# EAGLE design Driver Board Invert (EAGLE 9.2.2)
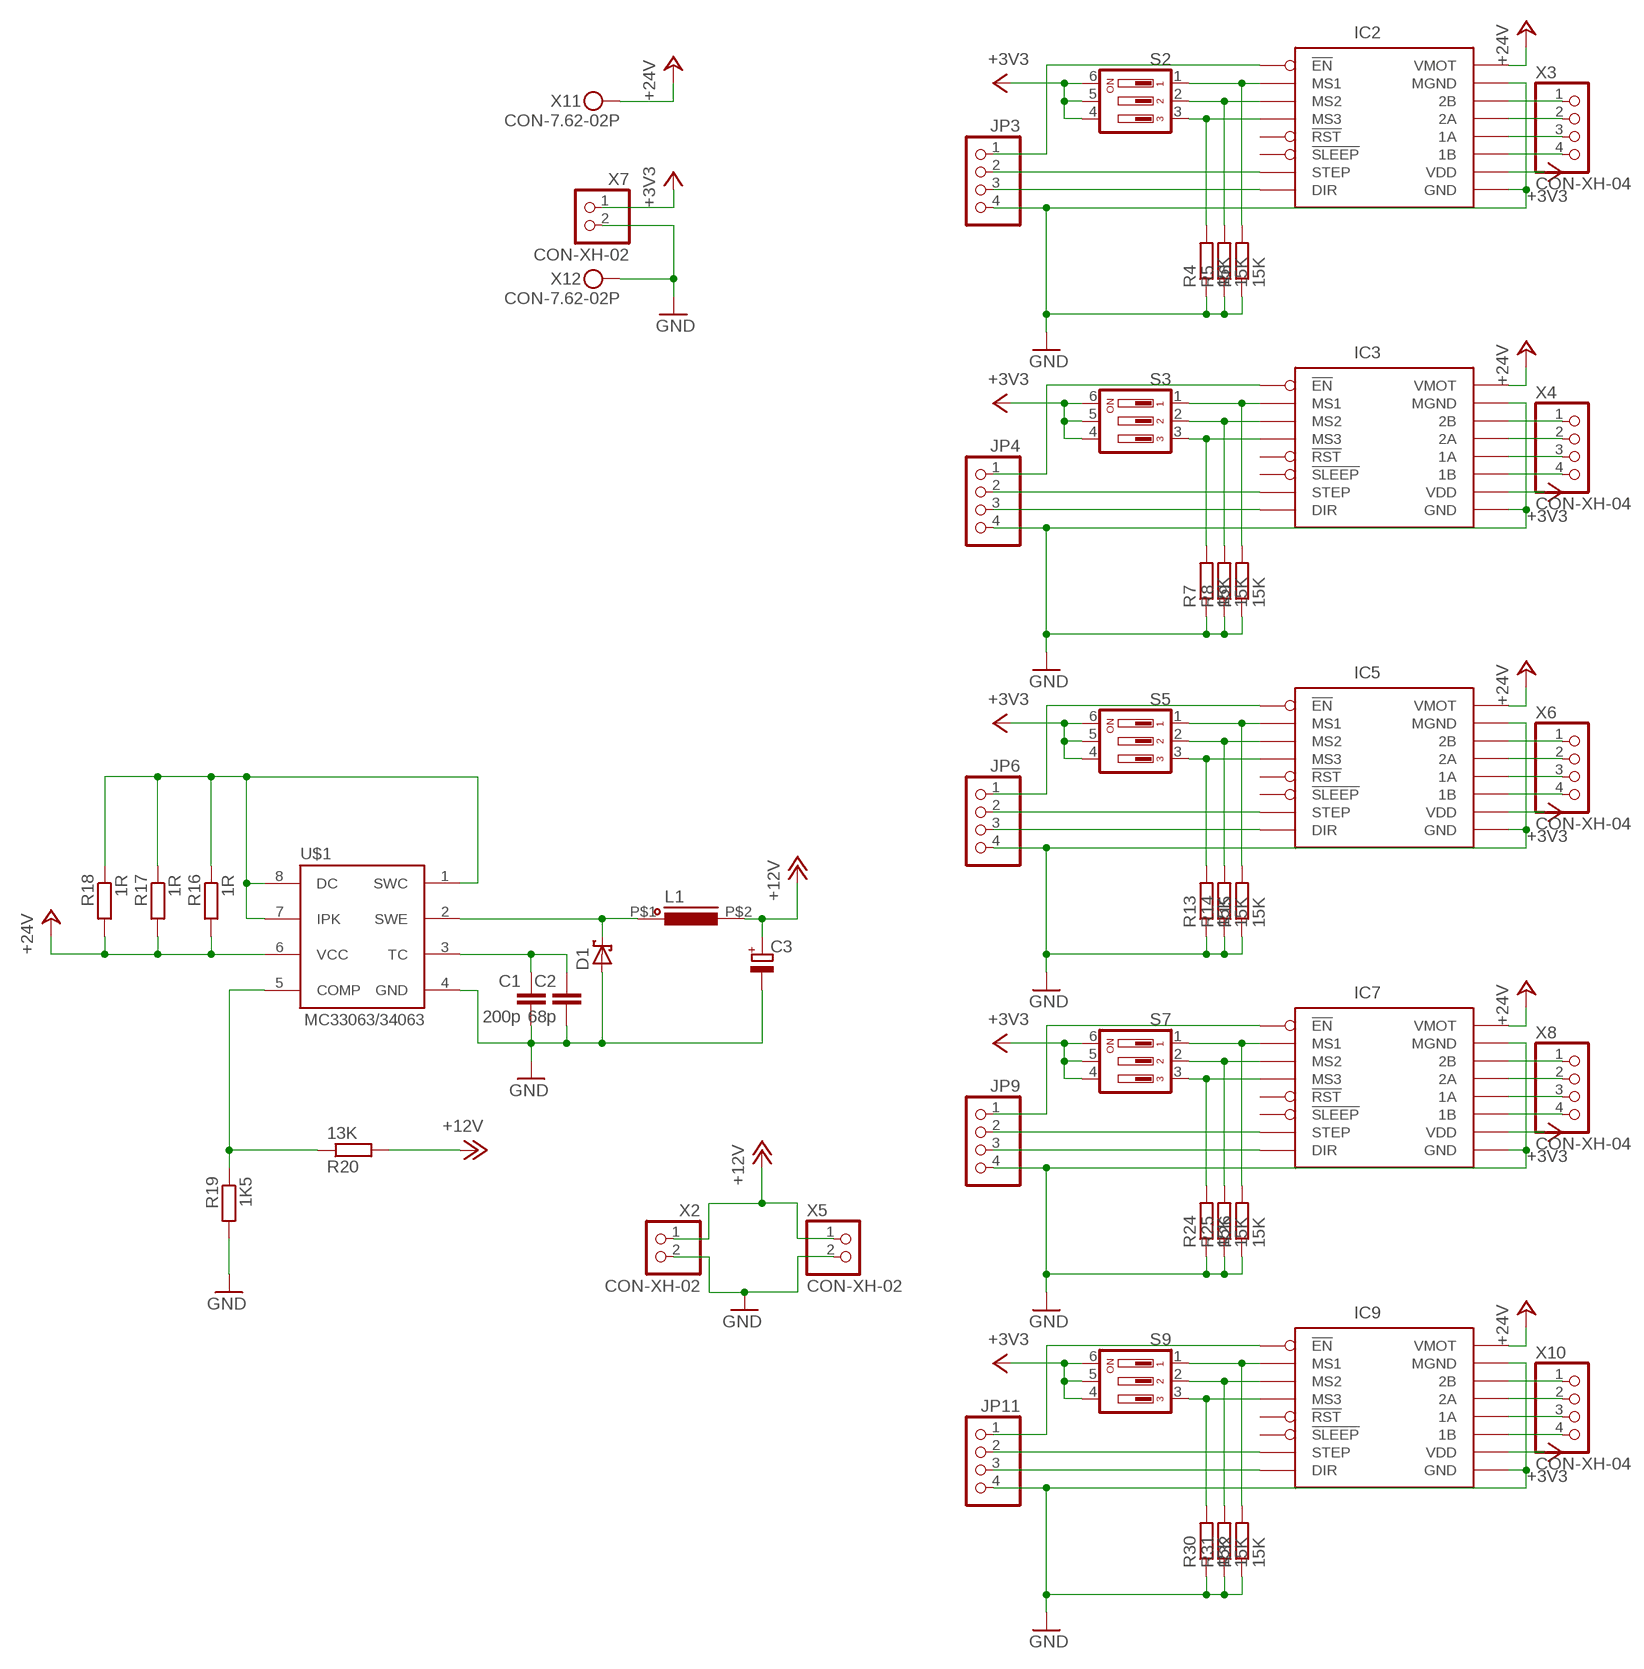
[diagram p0: schematic, sheet 1]

## Parts
C1  200p  CAP_0805  [C0805]
C2  68p  CAP_0805  [C0805]
C3  CAP-POL_E3.5-8  [E3,5-8]
D1  DIODE-SH_SMA  [DO214AC]
IC2  STEP-DRVST820-REV  [DRV-ST820-REV]
IC3  STEP-DRVST820-REV  [DRV-ST820-REV]
IC5  STEP-DRVST820-REV  [DRV-ST820-REV]
IC7  STEP-DRVST820-REV  [DRV-ST820-REV]
IC9  STEP-DRVST820-REV  [DRV-ST820-REV]
JP3  PINHD-1X4  [1X04]
JP4  PINHD-1X4  [1X04]
JP6  PINHD-1X4  [1X04]
JP9  PINHD-1X4  [1X04]
JP11  PINHD-1X4  [1X04]
L1  INDUCTORCW68  [CW68]
R4  15K  R_R0805  [RESC2012X50]
R5  15K  R_R0805  [RESC2012X50]
R6  15K  R_R0805  [RESC2012X50]
R7  15K  R_R0805  [RESC2012X50]
R8  15K  R_R0805  [RESC2012X50]
R9  15K  R_R0805  [RESC2012X50]
R13  15K  R_R0805  [RESC2012X50]
R14  15K  R_R0805  [RESC2012X50]
R15  15K  R_R0805  [RESC2012X50]
R16  1R  R_0805  [R0805]
R17  1R  R_0805  [R0805]
R18  1R  R_0805  [R0805]
R19  1K5  R_0805  [R0805]
R20  13K  R_0805  [R0805]
R24  15K  R_R0805  [RESC2012X50]
R25  15K  R_R0805  [RESC2012X50]
R26  15K  R_R0805  [RESC2012X50]
R30  15K  R_R0805  [RESC2012X50]
R31  15K  R_R0805  [RESC2012X50]
R32  15K  R_R0805  [RESC2012X50]
S2  SW-DIP03S  [DIP03YL]
S3  SW-DIP03S  [DIP03YL]
S5  SW-DIP03S  [DIP03YL]
S7  SW-DIP03S  [DIP03YL]
S9  SW-DIP03S  [DIP03YL]
U$1  MC33063/MC34063P  [DIL08]
X1  CON-7.62-02P  [KF25C-7.62-02P-13]
X2  CON-XH-02  [XH-02]
X3  CON-XH-04  [XH-04]
X4  CON-XH-04  [XH-04]
X5  CON-XH-02  [XH-02]
X6  CON-XH-04  [XH-04]
X7  CON-XH-02  [XH-02]
X8  CON-XH-04  [XH-04]
X10  CON-XH-04  [XH-04]

## Nets
+3V3: IC2.VDD IC3.VDD IC5.VDD IC7.VDD IC9.VDD S2.4 S2.5 S2.6 S3.4 S3.5 S3.6 S5.4 S5.5 S5.6 S7.4 S7.5 S7.6 S9.4 S9.5 S9.6 X7.1
+12V: C3.+ L1.P$2 R20.2 X2.1 X5.1
+24V: IC2.VM(VMOT) IC3.VM(VMOT) IC5.VM(VMOT) IC7.VM(VMOT) IC9.VM(VMOT) R16.2 R17.2 R18.2 U$1.6(VCC) X1.P$1
GND: C1.2 C2.2 C3.- D1.A IC2.GND@1(MGND) IC2.GND@2(GND) IC3.GND@1(MGND) IC3.GND@2(GND) IC5.GND@1(MGND) IC5.GND@2(GND) IC7.GND@1(MGND) IC7.GND@2(GND) IC9.GND@1(MGND) IC9.GND@2(GND) JP3.4 JP4.4 JP6.4 JP9.4 JP11.4 R4.1 R5.1 R6.1 R7.1 R8.1 R9.1 R13.1 R14.1 R15.1 R19.2 R24.1 R25.1 R26.1 R30.1 R31.1 R32.1 U$1.4(GND) X1.P$2 X2.2 X5.2 X7.2
N$9: IC2.EN(!EN) JP3.1
N$10: IC2.STEP JP3.2
N$11: IC2.DIR JP3.3
N$14: IC2.1B(2B) X3.1
N$15: IC2.2B(2A) X3.2
N$16: IC2.2A(1A) X3.3
N$17: IC2.1A(1B) X3.4
N$18: IC2.MS0(MS1) R6.2 S2.1
N$19: IC2.MS1(MS2) R5.2 S2.2
N$20: IC2.MS2(MS3) R4.2 S2.3
N$21: IC3.EN(!EN) JP4.1
N$22: IC3.STEP JP4.2
N$23: IC3.DIR JP4.3
N$24: IC3.1B(2B) X4.1
N$25: IC3.2B(2A) X4.2
N$26: IC3.2A(1A) X4.3
N$27: IC3.1A(1B) X4.4
N$28: IC3.MS0(MS1) R9.2 S3.1
N$29: IC3.MS1(MS2) R8.2 S3.2
N$30: IC3.MS2(MS3) R7.2 S3.3
N$41: IC5.EN(!EN) JP6.1
N$42: IC5.STEP JP6.2
N$43: IC5.DIR JP6.3
N$44: IC5.1B(2B) X6.1
N$45: IC5.2B(2A) X6.2
N$46: IC5.2A(1A) X6.3
N$47: IC5.1A(1B) X6.4
N$48: IC5.MS0(MS1) R15.2 S5.1
N$49: IC5.MS1(MS2) R14.2 S5.2
N$50: IC5.MS2(MS3) R13.2 S5.3
N$51: C1.1 C2.1 U$1.3(TC)
N$52: R16.1 R17.1 R18.1 U$1.1(SWC) U$1.7(IPK) U$1.8(DC)
N$54: D1.C L1.P$1 U$1.2(SWE)
N$55: R19.1 R20.1 U$1.5(COMP)
N$65: IC7.EN(!EN) JP9.1
N$66: IC7.STEP JP9.2
N$67: IC7.DIR JP9.3
N$68: IC7.1B(2B) X8.1
N$69: IC7.2B(2A) X8.2
N$70: IC7.2A(1A) X8.3
N$71: IC7.1A(1B) X8.4
N$72: IC7.MS0(MS1) R26.2 S7.1
N$73: IC7.MS1(MS2) R25.2 S7.2
N$74: IC7.MS2(MS3) R24.2 S7.3
N$85: IC9.EN(!EN) JP11.1
N$86: IC9.STEP JP11.2
N$87: IC9.DIR JP11.3
N$88: IC9.1B(2B) X10.1
N$89: IC9.2B(2A) X10.2
N$90: IC9.2A(1A) X10.3
N$91: IC9.1A(1B) X10.4
N$92: IC9.MS0(MS1) R32.2 S9.1
N$93: IC9.MS1(MS2) R31.2 S9.2
N$94: IC9.MS2(MS3) R30.2 S9.3
Unconnected: IC2.NC(!SLEEP) IC2.RST(!RST) IC3.NC(!SLEEP) IC3.RST(!RST) IC5.NC(!SLEEP) IC5.RST(!RST) IC7.NC(!SLEEP) IC7.RST(!RST) IC9.NC(!SLEEP) IC9.RST(!RST)

## Library data of the parts
C1 C2 = Namenlos:CAP_
C3 = Namenlos:CAP-POL_
D1 = Namenlos:DIODE-SH_
IC2 IC3 IC5 IC7 IC9 = Flamberm:STEP-DRV
JP3 JP4 JP6 JP9 JP11 = pinhead:PINHD-1X4: PIN HEADER
L1 = Namenlos:INDUCTOR
R4-R9 R13-R15 R24-R26 R30-R32 = Flamberm:R_
R16-R20 = Namenlos:R_
S2 S3 S5 S7 S9 = Namenlos:SW-DIP03S: DIL/CODE SWITCH; OC_FARNELL: unknown; OC_NEWARK: unknown
U$1 = adafruit:MC33063/MC34063: MC33063 and MC34063 Basic DC/DC converter with internal power-NPN transistor, 100KHz, 1.5A peak switch current. 3-40 input/output.
X1 = Namenlos:CON-7.62-02P
X2 X5 X7 = Flamberm:CON-XH-02
X3 X4 X6 X8 X10 = Namenlos:CON-XH-04

## Board
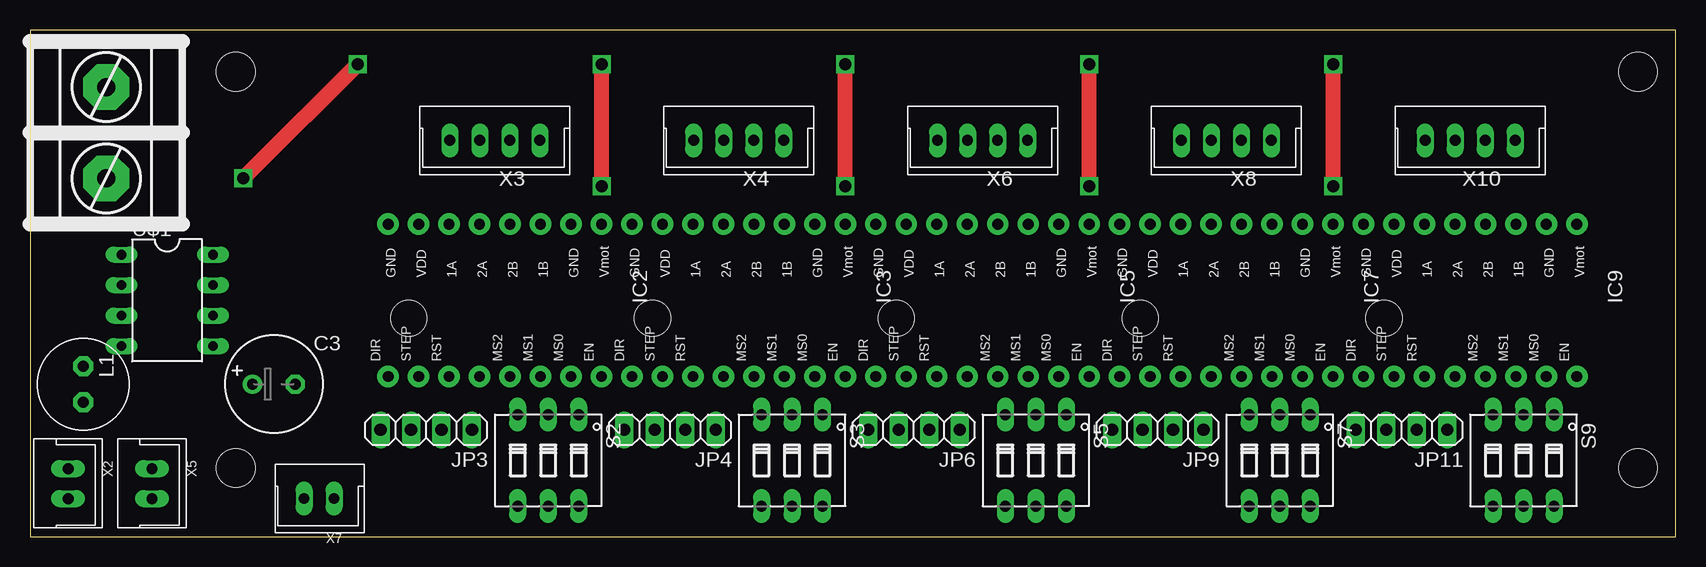
[diagram p1: board, top side]
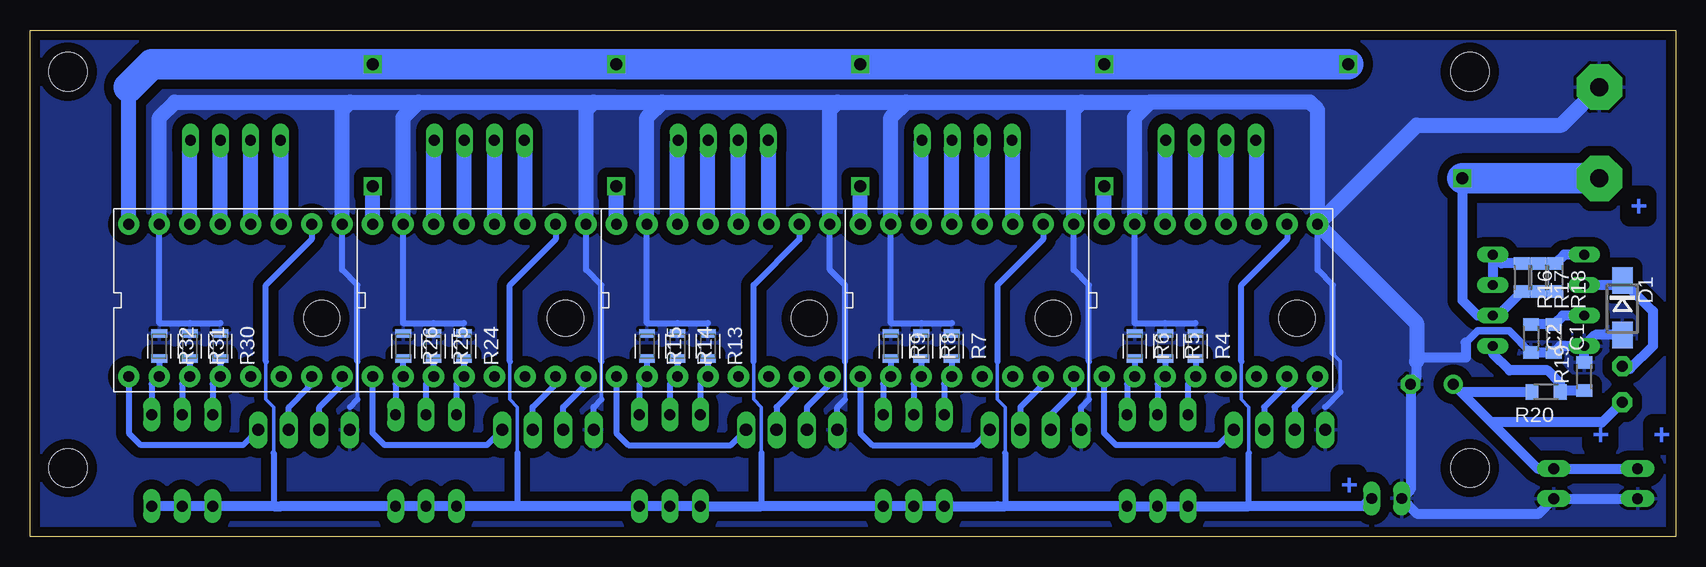
[diagram p2: board, bottom side, seen from below]

Size 137.14 x 42.22 mm. Coordinates in mm from the lower left corner, seen from the top.
Outline: 0,0 137.14,0 137.14,42.22 0,42.22 0,0
Copper layers (1*16): Top 0.035mm / dielectric 1.5mm / Bottom 0.035mm
Design rules "EagleDesignRules": minimum track width 0.25mm, minimum drill 0.3mm, track to track 0.25mm, track to pad 0.25mm, pad to pad 0.25mm, via to via 0.25mm, smd to smd 0.25mm, copper to edge 0.5mm, drill to drill 0.5mm, minimum pad ring 10mil, minimum via ring 8mil, stop-mask expansion 4mil, vias tented up to drill 0mil, thermal gap 0.25mm
Holes 3.2 mm at 17.14,5.71 133.99,5.71 17.14,38.73 133.99,38.73

### Footprints (pad centres in the part's own frame; a part is rotated, then mirrored left to right if it is on the bottom)
C0805 = smd 1.05 x 1.3: 1 -1.175,0; 2 1.175,0
E3,5-8 = drill 0.9 pad 1.6: + -1.778,0 | drill 0.9 pad 1.6 octagon: - 1.778,0
DO214AC = smd 2.2 x 1.7: A 2.25,0; C -2.285,0
DRV-ST820-REV = drill 0.9 pad 1.778: 1A 3.81,-6.35; 1B -3.81,-6.35; 2A 1.27,-6.35; 2B -1.27,-6.35; DIR 8.89,6.35; EN -8.89,6.35; GND@1 -6.35,-6.35; GND@2 8.89,-6.35; MS0 -6.35,6.35; MS1 -3.81,6.35; MS2 -1.27,6.35; NC 1.27,6.35; RST 3.81,6.35; STEP 6.35,6.35; VDD 6.35,-6.35; VM -8.89,-6.35 | hole 3: 7.18,1.5
1X04 = drill 1.016 long: 1 -3.81,0; 2 -1.27,0; 3 1.27,0; 4 3.81,0
CW68 = drill 0.9 pad 1.676 octagon: P$1 -1.5,0; P$2 1.5,0
RESC2012X50 = smd 0.712 x 1.312: 1 -1.05,0; 2 1.05,0
R0805 = smd 1.05 x 1.3: 1 -1.175,0; 2 1.175,0
DIP03YL = drill 0.9 long: 1 -2.54,-3.81; 2 0,-3.81; 3 2.54,-3.81; 4 2.54,3.81; 5 0,3.81; 6 -2.54,3.81
DIL08 = drill 0.813 long: 1 -3.81,-3.81; 2 -1.27,-3.81; 3 1.27,-3.81; 4 3.81,-3.81; 5 3.81,3.81; 6 1.27,3.81; 7 -1.27,3.81; 8 -3.81,3.81
KF25C-7.62-02P-13 = drill 1.5 pad 3.81 octagon: P$1 -3.81,0; P$2 3.81,0
XH-02 = drill 0.9 long: 1 -1.21,0; 2 1.29,0
XH-04 = drill 0.9 long: 1 -3.75,0; 2 -1.25,0; 3 1.25,0; 4 3.75,0

### Placement (x,y rotation side)
C1  10.16,16.51 270 bottom
C2  12.06,16.51 270 bottom
C3  20.32,12.7 0 top
D1  4.45,19.05 270 bottom
IC2  38.73,19.68 180 top
IC3  59.05,19.68 180 top
IC5  79.38,19.68 180 top
IC7  99.69,19.68 180 top
IC9  120.02,19.68 180 top
JP3  33.02,8.89 180 top
JP4  53.34,8.89 180 top
JP6  73.66,8.89 180 top
JP9  93.98,8.89 180 top
JP11  114.3,8.89 180 top
L1  4.45,12.7 270 top
R4  40.01,15.88 270 bottom
R5  42.55,15.88 270 bottom
R6  45.09,15.88 270 bottom
R7  60.33,15.88 270 bottom
R8  62.87,15.88 270 bottom
R9  65.41,15.88 270 bottom
R13  80.64,15.88 270 bottom
R14  83.19,15.88 270 bottom
R15  85.72,15.88 270 bottom
R16  12.83,21.59 270 bottom
R17  11.43,21.59 270 bottom
R18  10.03,21.59 270 bottom
R19  7.62,13.34 90 bottom
R20  10.79,12.06 180 bottom
R24  100.97,15.88 270 bottom
R25  103.5,15.88 270 bottom
R26  106.05,15.88 270 bottom
R30  121.28,15.88 270 bottom
R31  123.83,15.88 270 bottom
R32  126.36,15.88 270 bottom
S2  43.18,6.35 180 top
S3  63.5,6.35 180 top
S5  83.82,6.35 180 top
S7  104.14,6.35 180 top
S9  124.46,6.35 180 top
U$1  11.43,19.68 270 top
X1  6.35,33.66 90 top
X2  3.17,4.45 270 top
X3  38.73,33.02 180 top
X4  59.05,33.02 180 top
X5  10.16,4.45 270 top
X6  79.38,33.02 180 top
X7  24.13,3.17 180 top
X8  99.69,33.02 180 top
X10  120.02,33.02 180 top

### Tracks (layer width: path | path; a pad name or v marks a point on that pad's centre or on a via)
+3V3
  Bottom 0.305: 35.56,6.99 35.56,10.79 36.2,11.43 36.2,14.61 | 55.88,6.99 55.88,10.79 56.52,11.43 56.52,14.61 | 76.2,6.99 76.2,7.62 76.2,10.79 76.83,11.43 76.83,14.61 | 96.52,6.99 96.52,10.79 97.16,11.43 97.16,14.61 | 116.84,6.99 116.84,10.79 117.47,11.43 117.47,14.61
  Bottom 0.508: 36.2,14.61 36.2,20.95 32.38,24.77 IC2.VDD | 35.56,2.54 35.56,6.99 | 56.52,14.61 56.52,20.95 52.7,24.77 IC3.VDD | 60.33,2.54 S3.4 | 55.88,6.99 55.88,2.54 | 76.83,14.61 76.83,20.95 73.03,24.77 IC5.VDD | 76.2,6.99 76.2,2.54 | 97.16,14.61 97.16,20.95 93.34,24.77 IC7.VDD | 96.52,6.99 96.52,2.54 | 117.47,14.61 117.47,20.95 113.67,24.77 IC9.VDD | 116.84,6.99 116.84,2.54 116.2,2.54
  Bottom 0.813: 60.33,2.54 56.52,2.54 55.88,2.54 S2.6 S2.5 S2.4 35.56,2.54 26.09,2.54 25.46,3.17 X7.1 | S3.4 S3.5 S3.6 76.2,2.54 S5.4 S5.5 S5.6 96.52,2.54 99.69,2.54 S7.4 S7.5 S7.6 116.2,2.54 116.84,2.54 120.02,2.54 S9.4 S9.5 S9.6
+12V
  Bottom 0.813: L1.P$2 6.12,9.53 15.37,9.53 | 15.37,9.53 C3.+ | C3.+ 17.91,12.06 R20.2 | C3.+ 18.41,12.7 | X2.1 X5.1 11.5,5.66 15.37,9.53
+24V  (via drill 1)
  Top 1.27: v88.27,29.21 v88.27,39.37 | v108.58,29.21 v108.58,39.37 | v27.3,39.37 18.41,30.48 v17.78,29.84 | v67.94,29.21 v67.94,39.37 | v47.62,29.21 v47.62,39.37
  Bottom 0.813: R18.2 R17.2 R16.2 14.83,18.41 U$1.6 16.51,18.41 17.78,19.68 17.78,25.4 v17.78,29.84
  Bottom 1.27: IC9.VM 128.91,37.47 | IC7.VM v108.58,29.21 | IC5.VM v88.27,29.21 | IC3.VM v67.94,29.21 | IC2.VM v47.62,29.21
  Bottom 2.54: 128.91,37.47 127,39.37 v108.58,39.37 v88.27,39.37 v67.94,39.37 v47.62,39.37 v27.3,39.37 | X1.P$1 v17.78,29.84
GND
  Bottom 0.305: 28.57,15.24 27.94,14.61 27.94,12.06 | 48.9,11.43 48.9,14.61 | 69.22,11.43 69.22,14.61 | 89.53,11.43 89.53,14.61 | 109.86,11.43 109.86,14.61
  Bottom 0.508: 40.01,17.78 42.55,17.78 45.09,17.78 IC2.GND@1 | 29.21,10.79 27.94,12.06 | 28.57,15.24 28.57,20.95 29.84,22.23 IC2.GND@2 | 60.33,17.78 62.87,17.78 65.41,17.78 IC3.GND@1 | JP4.4 49.53,10.79 48.9,11.43 | 48.9,14.61 48.9,20.95 50.16,22.23 IC3.GND@2 | 80.64,17.78 83.19,17.78 85.72,17.78 IC5.GND@1 | JP6.4 69.85,10.79 69.22,11.43 | 69.22,14.61 69.22,20.95 70.48,22.23 IC5.GND@2 | 100.97,17.78 103.5,17.78 106.05,17.78 IC7.GND@1 | JP9.4 90.17,10.79 89.53,11.43 | 89.53,14.61 89.53,20.95 90.81,22.23 IC7.GND@2 | 121.28,17.78 123.83,17.78 126.36,17.78 IC9.GND@1 | 110.49,10.79 109.86,11.43 | 109.86,14.61 109.86,20.95 111.12,22.23 IC9.GND@2
  Bottom 0.61: C2.2 13.88,17.14 16.51,17.14 17.5,16.15
  Bottom 0.813: R19.2 U$1.4 | C2.2 C1.2 9.62,15.88 U$1.4 | 17.5,16.15 17.5,14.96 17.46,14.92 21.27,14.92 21.59,15.24 21.59,14.61 21.59,13.21 C3.- 22.1,3.92 X7.2 21.57,1.91 11.41,1.91 X5.2 X2.2 | D1.A 6.7,16.8 U$1.4
  Bottom 1.27: IC2.GND@1 45.09,34.92 43.81,36.2 | IC2.GND@2 29.84,35.56 30.48,36.2 43.81,36.2 | IC3.GND@1 65.41,34.92 64.14,36.2 | 64.14,36.2 49.53,36.2 | IC3.GND@2 50.16,35.56 49.53,36.2 | IC5.GND@1 85.72,34.92 84.45,36.2 | 84.45,36.2 69.85,36.2 | IC5.GND@2 70.48,35.56 69.85,36.2 | IC7.GND@1 106.05,34.92 104.78,36.2 | 104.78,36.2 90.17,36.2 | IC7.GND@2 90.81,35.56 90.17,36.2 | IC9.GND@1 126.36,34.92 125.09,36.2 110.49,36.2 | IC9.GND@2 111.12,35.56 110.49,36.2 | IC2.GND@2 21.59,17.78 21.59,14.61 | 49.53,36.2 43.81,36.2 | 69.85,36.2 64.14,36.2 | 90.17,36.2 84.45,36.2 | 110.49,36.2 104.78,36.2 | IC2.GND@2 21.59,34.29 9.53,34.29 X1.P$2
  pour Bottom (isolate 0.813, rank 6): 137.14,0 0,0 0,42.22 137.14,42.22
N$9
  Bottom 0.508: IC2.EN 47.62,8.62 46.62,7.62 38.1,7.62 JP3.1
N$10
  Bottom 0.508: JP3.2 34.29,10.79 32.38,12.7 IC2.STEP
N$11
  Bottom 0.508: JP3.3 31.75,10.79 29.84,12.7 IC2.DIR
N$14
  Bottom 1.27: IC2.1B 42.55,32.96 X3.1
N$15
  Bottom 1.27: IC2.2B 40.01,33 X3.2
N$16
  Bottom 1.27: IC2.2A 37.47,33 X3.3
N$17
  Bottom 1.27: IC2.1A 34.92,32.96 X3.4
N$18
  Bottom 0.508: S2.1 45.72,12.7 IC2.MS0 R6.2
N$19
  Bottom 0.508: S2.2 43.18,12.7 IC2.MS1 R5.2
N$20
  Bottom 0.508: S2.3 40.64,12.7 IC2.MS2 R4.2
N$21
  Bottom 0.508: JP4.1 58.42,7.62 66.94,7.62 67.94,8.62 IC3.EN
N$22
  Bottom 0.508: JP4.2 54.61,10.79 53.34,12.06 52.7,12.7 IC3.STEP
N$23
  Bottom 0.508: IC3.DIR 50.16,12.06 52.07,10.16 JP4.3
N$24
  Bottom 1.27: IC3.1B 62.87,32.96 X4.1
N$25
  Bottom 1.27: IC3.2B 60.33,33 X4.2
N$26
  Bottom 1.27: IC3.2A 57.78,33 X4.3
N$27
  Bottom 1.27: IC3.1A 55.24,32.96 X4.4
N$28
  Bottom 0.508: S3.1 66.04,12.7 IC3.MS0 R9.2
N$29
  Bottom 0.508: S3.2 63.5,12.7 IC3.MS1 R8.2
N$30
  Bottom 0.508: S3.3 60.96,12.7 IC3.MS2 R7.2
N$41
  Bottom 0.508: IC5.EN 88.27,8.62 87.27,7.62 78.74,7.62 JP6.1
N$42
  Bottom 0.508: JP6.2 74.93,10.79 73.03,12.7 IC5.STEP
N$43
  Bottom 0.508: 70.48,12.7 70.8,12.38 | 70.8,12.38 72.39,10.79 JP6.3 | IC5.DIR 70.48,12.7 | 70.48,12.7 70.8,12.38
N$44
  Bottom 1.27: IC5.1B 83.19,32.96 X6.1
N$45
  Bottom 1.27: IC5.2B 80.64,33 X6.2
N$46
  Bottom 1.27: IC5.2A 78.11,33 X6.3
N$47
  Bottom 1.27: IC5.1A 75.56,32.96 X6.4
N$48
  Bottom 0.508: S5.1 86.36,12.7 IC5.MS0 R15.2
N$49
  Bottom 0.508: S5.2 83.82,12.7 IC5.MS1 R14.2
N$50
  Bottom 0.508: S5.3 81.28,12.7 IC5.MS2 R13.2
N$51
  Bottom 0.813: C2.1 C1.1 9.43,18.41 U$1.3
N$52
  Bottom 0.813: U$1.1 9.3,23.5 R18.1 R17.1 R16.1 14.51,22.77 U$1.8 U$1.7
N$54
  Bottom 0.813: L1.P$1 4.21,13.97 3.81,13.97 1.91,15.88 1.91,18.8 D1.C 4.83,20.95 U$1.2
N$55
  Bottom 0.813: R19.1 9.53,12.16 R20.1 9.62,12.79 10.67,13.84 13.84,13.84 15.24,15.24 U$1.5
N$65
  Bottom 0.508: IC7.EN 108.58,8.62 107.58,7.62 99.06,7.62 JP9.1
N$66
  Bottom 0.508: JP9.2 95.25,10.79 93.34,12.7 IC7.STEP
N$67
  Bottom 0.508: JP9.3 92.71,10.79 90.81,12.7 IC7.DIR
N$68
  Bottom 1.27: IC7.1B 103.5,32.96 X8.1
N$69
  Bottom 1.27: IC7.2B 100.97,33 X8.2
N$70
  Bottom 1.27: IC7.2A 98.42,33 X8.3
N$71
  Bottom 1.27: IC7.1A 95.89,32.96 X8.4
N$72
  Bottom 0.508: S7.1 106.68,12.7 IC7.MS0 R26.2
N$73
  Bottom 0.508: S7.2 104.14,12.7 IC7.MS1 R25.2
N$74
  Bottom 0.508: S7.3 101.6,12.7 IC7.MS2 R24.2
N$85
  Bottom 0.508: JP11.1 119.38,7.62 127.91,7.62 128.91,8.62 IC9.EN
N$86
  Bottom 0.508: 113.98,12.38 115.57,10.79 JP11.2 | 113.98,12.38 113.67,12.7 | IC9.STEP 113.98,13.02 113.98,12.38
N$87
  Bottom 0.508: JP11.3 113.03,10.79 111.12,12.7 IC9.DIR
N$88
  Bottom 1.27: IC9.1B 123.83,32.96 X10.1
N$89
  Bottom 1.27: IC9.2B 121.28,33 X10.2
N$90
  Bottom 1.27: IC9.2A 118.75,33 X10.3
N$91
  Bottom 1.27: IC9.1A 116.2,32.96 X10.4
N$92
  Bottom 0.508: S9.1 127,12.7 IC9.MS0 R32.2
N$93
  Bottom 0.508: S9.2 124.46,12.7 IC9.MS1 R31.2
N$94
  Bottom 0.508: S9.3 121.92,12.7 IC9.MS2 R30.2

### Text on the board
Bottom: + | + | + | +